# Altium schematic sheet POWER.SchDoc
size A4
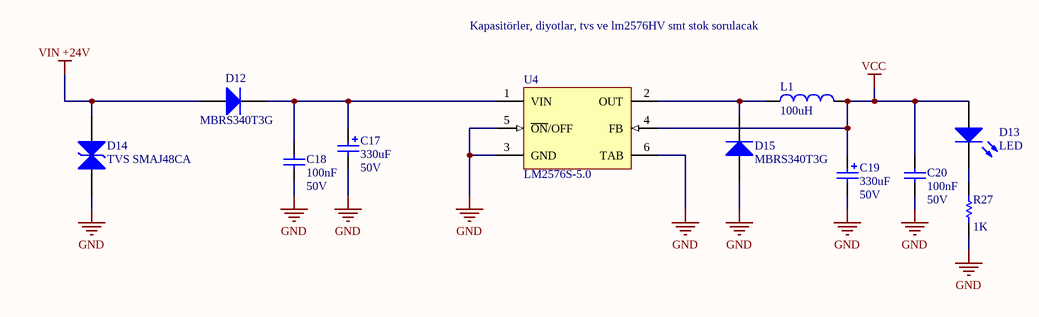
[diagram p0: POWER.SchDoc]

## Parts
C17  value 330uF  Voltage: 50V  [CAP Size H13= 12.5x13.8mm]  (hidden comment: Cap Pol1)
C18  value 100nF  Voltage: 50V  [3-0603_L]  (hidden comment: Cap)
C19  value 330uF  Voltage: 50V  [CAP Size H13= 12.5x13.8mm]  (hidden comment: Cap Pol1)
C20  value 100nF  Voltage: 50V  [3-0603_L]  (hidden comment: Cap)
D12  MBRS340T3G  [CASE 403-03 ISSUE E]
D13  LED  [6-0805 - LED]
D14  TVS SMAJ48CA  [DO214 AA]
D15  MBRS340T3G  [CASE 403-03 ISSUE E]
L1  value 100uH  [EB-221M18G01]  (hidden comment: Inductor)
R27  value 1K  [6-0805_M]  (hidden comment: Res1)
U4  LM2576S-5.0  [TS5B_M]

## Nets
GND: C17.2 C18.1 C19.2 C20.1 D14.1 D15.1(A) R27.1 U4.3(GND) U4.5(~{ON}/OFF) U4.6(TAB)
VCC: C19.1 C20.2 D13.1(A) L1.2 U4.4(FB)
VIN +24V: D12.1(A) D14.2
NetC17_1: C17.1 C18.2 D12.2(K) U4.1(VIN)
NetD13_2: D13.2(K) R27.2
NetD15_2: D15.2(K) L1.1 U4.2(OUT)

## Notes on the sheet
- Kapasitörler, diyotlar, tvs ve lm2576HV smt stok sorulacak

## Library data of the parts
C17 C19 = Cap Pol1: Polarized Capacitor (Radial); Published: 8-Jun-2000; Revision: July-2002: Re-released for DXP Platform.; Publisher: Altium Limited
C18 C20 = Cap: Capacitor; Published: 8-Jun-2000; Revision: July-2002: Re-released for DXP Platform.; Publisher: Altium Limited
D12 D15 = MBRS340T3G: 3 Amp Shotky Rectifier; Published: 8-Jun-2000; LatestRevisionDate: 17-Jul-2002; LatestRevisionNote: Re-released for DXP Platform.; DatasheetDocument: 1998; PackageDocument: Aug-1999; Publisher: Altium Limited; ComponentLink1Description: Manufacturer Link; ComponentLink2Description: Datasheet
D13 = LED: Typical INFRARED GaAs LED; Published: 8-Jun-2000; LatestRevisionDate: 08-Jul-2005; LatestRevisionNote: Mech Layer 1 removed.; PackageReference: LED-0; Publisher: Altium Limited
L1 = Inductor: Code_IEC: 1005; Published: 8-Jun-2000; LatestRevisionDate: 17-Jul-2002; LatestRevisionNote: Re-released for DXP Platform.; PackageReference: 0402-A; Publisher: Altium Limited; Code_JEITA: 0402
R27 = Res1: Resistor; Published: 8-Jun-2000; LatestRevisionDate: 17-Jul-2002; LatestRevisionNote: Re-released for DXP Platform.; PackageReference: AXIAL-0.3; Publisher: Altium Limited
U4 = LM2576S-5.0: SIMPLE SWITCHER; 3A Step-Down Voltage Regulator; Manufacturer: National Semiconductor; PackageTopMarking: NSUZXYTT*LM2576S*-5.0 P+; Published: 4-Dec-2008; PackageVersion: revD, Apr-2005; PackageReference: TS5B; Publisher: Altium Limited; PackageDescription: TO-263, Molded, .400 x .390 x .180in, 5 Lead, .067in Pitch, Surface Mount; CompType: Switcher; PartNumber: LM2576S-5.0; RoHS: O; PinCount: 5; DigiKeyPartNumber: LM2576S-5.0-ND; Code_JEDEC: MO-169-AB; ComponentLink1Description: LM2576 Datasheet; ComponentLink1URL: http://www.national.com/ds/LM/LM2576.pdf; ComponentLink2Description: LM2576 Web Page; ComponentLink2URL: http://www.national.com/pf/LM/LM2576.html; ComponentLink3Description: TS5B Package Page; ComponentLink3URL: http://www.national.com/packaging/folders/ts5b.html
D14 = TVS SMAJ48CA: Published: 8-Jun-2000; LatestRevisionDate: 17-Jul-2002; LatestRevisionNote: Re-released for DXP Platform.; DatasheetDocument: 1998; PackageDocument: Aug-1999; PackageReference: DO-41; Publisher: Altium Limited; Code_JEDEC: DO-204-AL; ComponentLink1Description: Manufacturer Link; ComponentLink1URL: http://www.fairchildsemi.com/; ComponentLink2Description: Datasheet; ComponentLink2URL: http://www.fairchildsemi.com/ds/1N%2F1N4001.pdf